# EAGLE design usbledminiv1 (EAGLE 5.06)
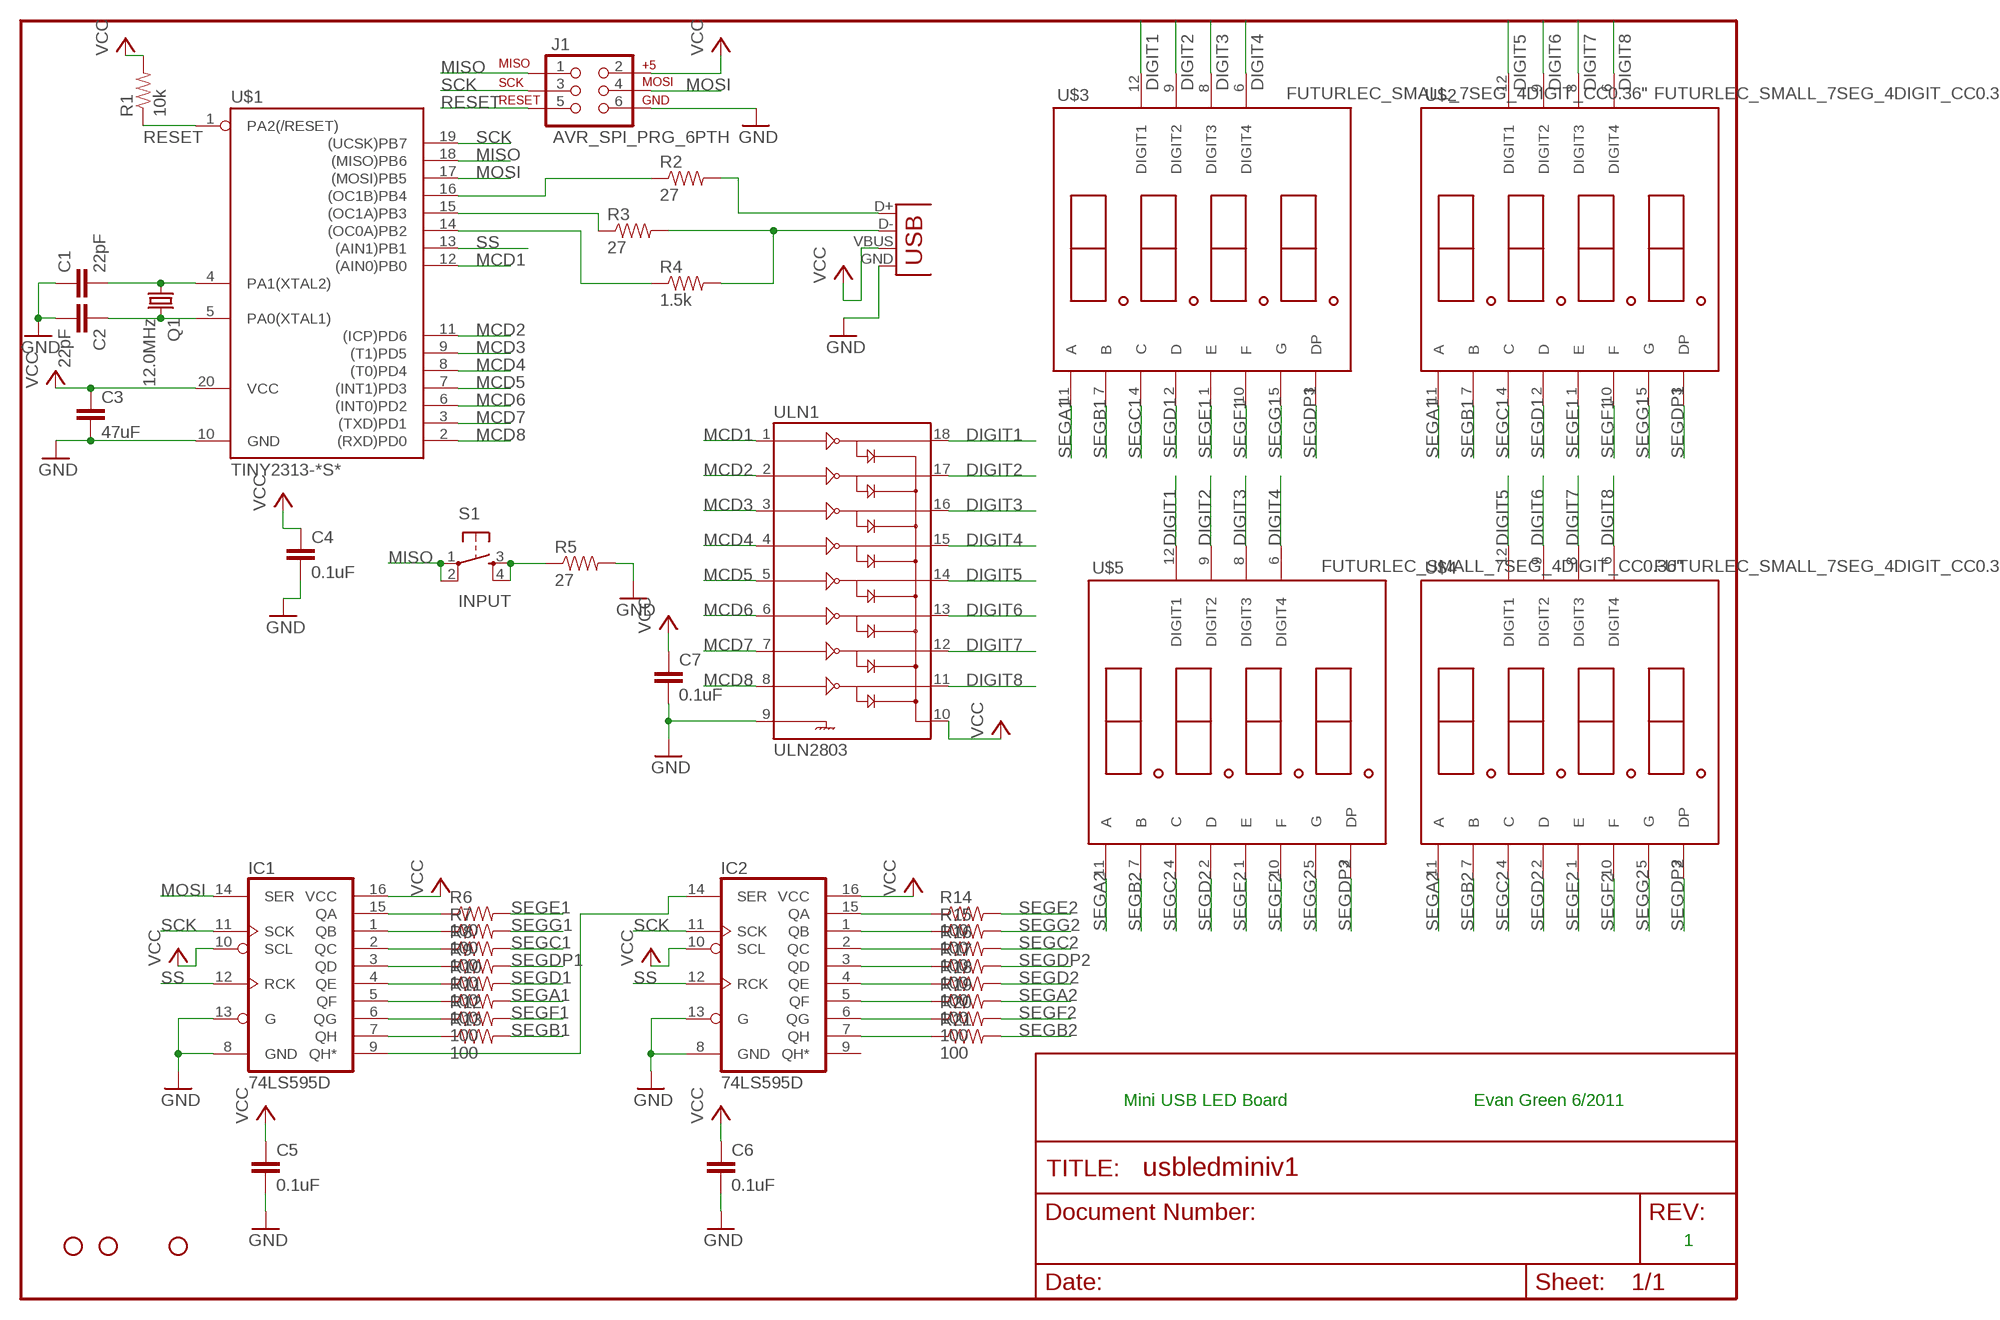
[diagram p0: schematic, sheet 1]

## Parts
C1  22pF  CAP0402-CAP  [0402-CAP]
C2  22pF  CAP0402-CAP  [0402-CAP]
C3  47uF  CAP1210  [1210]
C4  0.1uF  CAP0402-CAP  [0402-CAP]
C5  0.1uF  CAP0402-CAP  [0402-CAP]
C6  0.1uF  CAP0402-CAP  [0402-CAP]
C7  0.1uF  CAP0402-CAP  [0402-CAP]
IC1  74LS595D  [SO16]
IC2  74LS595D  [SO16]
J1  AVR_SPI_PRG_6PTH  [2X3]
JP1  STAND-OFF  [STAND-OFF]
JP2  STAND-OFF  [STAND-OFF]
JP4  STAND-OFF  [STAND-OFF]
Q1  12.0MHz  CRYSTALTC38H  [TC38H]
R1  10k  RESISTOR0402-RES  [0402-RES]
R2  27  RESISTOR0402-RES  [0402-RES]
R3  27  RESISTOR0402-RES  [0402-RES]
R4  1.5k  RESISTOR0402-RES  [0402-RES]
R5  27  RESISTOR0402-RES  [0402-RES]
R6  100  RESISTOR0402-RES  [0402-RES]
R7  100  RESISTOR0402-RES  [0402-RES]
R8  100  RESISTOR0402-RES  [0402-RES]
R9  100  RESISTOR0402-RES  [0402-RES]
R10  100  RESISTOR0402-RES  [0402-RES]
R11  100  RESISTOR0402-RES  [0402-RES]
R12  100  RESISTOR0402-RES  [0402-RES]
R13  100  RESISTOR0402-RES  [0402-RES]
R14  100  RESISTOR0402-RES  [0402-RES]
R15  100  RESISTOR0402-RES  [0402-RES]
R16  100  RESISTOR0402-RES  [0402-RES]
R17  100  RESISTOR0402-RES  [0402-RES]
R18  100  RESISTOR0402-RES  [0402-RES]
R19  100  RESISTOR0402-RES  [0402-RES]
R20  100  RESISTOR0402-RES  [0402-RES]
R21  100  RESISTOR0402-RES  [0402-RES]
S1  INPUT  TAC_SWITCHSMD  [TACTILE_SWITCH_SMD]
U$1  TINY2313-*S*  [SO20L$]
U$2  FUTURLEC_SMALL_7SEG_4DIGIT_CC0.36"  [FUTURLEC_SMALL_7SEG_4DIGIT_CC]
U$3  FUTURLEC_SMALL_7SEG_4DIGIT_CC0.36"  [FUTURLEC_SMALL_7SEG_4DIGIT_CC]
U$4  FUTURLEC_SMALL_7SEG_4DIGIT_CC0.36"  [FUTURLEC_SMALL_7SEG_4DIGIT_CC]
U$5  FUTURLEC_SMALL_7SEG_4DIGIT_CC0.36"  [FUTURLEC_SMALL_7SEG_4DIGIT_CC]
ULN1  ULN2803  ULN2803SOICW  [SO18L]
X1  USBSMD  [USB-MINIB]

## Nets
DIGIT1: U$3.12(DIGIT1) U$5.12(DIGIT1) ULN1.18
DIGIT2: U$3.9(DIGIT2) U$5.9(DIGIT2) ULN1.17
DIGIT3: U$3.8(DIGIT3) U$5.8(DIGIT3) ULN1.16
DIGIT4: U$3.6(DIGIT4) U$5.6(DIGIT4) ULN1.15
DIGIT5: U$2.12(DIGIT1) U$4.12(DIGIT1) ULN1.14
DIGIT6: U$2.9(DIGIT2) U$4.9(DIGIT2) ULN1.13
DIGIT7: U$2.8(DIGIT3) U$4.8(DIGIT3) ULN1.12
DIGIT8: U$2.6(DIGIT4) U$4.6(DIGIT4) ULN1.11
GND: C1.1 C2.2 C3.2 C4.2 C5.2 C6.2 C7.2 IC1.8(GND) IC1.13(G) IC2.8(GND) IC2.13(G) J1.6 R5.2 U$1.10(GND) ULN1.9 X1.GND
MCD1: U$1.12((AIN0)PB0) ULN1.1
MCD2: U$1.11((ICP)PD6) ULN1.2
MCD3: U$1.9((T1)PD5) ULN1.3
MCD4: U$1.8((T0)PD4) ULN1.4
MCD5: U$1.7((INT1)PD3) ULN1.5
MCD6: U$1.6((INT0)PD2) ULN1.6
MCD7: U$1.3((TXD)PD1) ULN1.7
MCD8: U$1.2((RXD)PD0) ULN1.8
MISO: J1.1 S1.1 S1.2 U$1.18((MISO)PB6)
MOSI: IC1.14(SER) J1.4 U$1.17((MOSI)PB5)
N$1: IC1.7(QH) R13.1
N$2: C1.2 Q1.1 U$1.4(PA1(XTAL2))
N$4: C2.1 Q1.2 U$1.5(PA0(XTAL1))
N$6: IC1.9(QH*) IC2.14(SER)
N$9: IC1.1(QB) R7.1
N$10: IC1.2(QC) R8.1
N$11: IC1.15(QA) R6.1
N$12: IC1.3(QD) R9.1
N$13: IC1.4(QE) R10.1
N$14: R2.1 U$1.16((OC1B)PB4)
N$15: R3.1 U$1.15((OC1A)PB3)
N$16: R4.1 U$1.14((OC0A)PB2)
N$17: IC1.5(QF) R11.1
N$18: IC1.6(QG) R12.1
N$19: IC2.1(QB) R15.1
N$23: R5.1 S1.3 S1.4
N$28: R3.2 R4.2 X1.D-
N$29: R2.2 X1.D+
N$32: IC2.15(QA) R14.1
N$33: IC2.2(QC) R16.1
N$34: IC2.3(QD) R17.1
N$35: IC2.4(QE) R18.1
N$36: IC2.5(QF) R19.1
N$37: IC2.6(QG) R20.1
N$38: IC2.7(QH) R21.1
RESET: J1.5 R1.1 U$1.1(PA2(/RESET))
SCK: IC1.11(SCK) IC2.11(SCK) J1.3 U$1.19((UCSK)PB7)
SEGA1: R11.2 U$2.11(A) U$3.11(A)
SEGA2: R19.2 U$4.11(A) U$5.11(A)
SEGB1: R13.2 U$2.7(B) U$3.7(B)
SEGB2: R21.2 U$4.7(B) U$5.7(B)
SEGC1: R8.2 U$2.4(C) U$3.4(C)
SEGC2: R16.2 U$4.4(C) U$5.4(C)
SEGD1: R10.2 U$2.2(D) U$3.2(D)
SEGD2: R18.2 U$4.2(D) U$5.2(D)
SEGDP1: R9.2 U$2.3(DP) U$3.3(DP)
SEGDP2: R17.2 U$4.3(DP) U$5.3(DP)
SEGE1: R6.2 U$2.1(E) U$3.1(E)
SEGE2: R14.2 U$4.1(E) U$5.1(E)
SEGF1: R12.2 U$2.10(F) U$3.10(F)
SEGF2: R20.2 U$4.10(F) U$5.10(F)
SEGG1: R7.2 U$2.5(G) U$3.5(G)
SEGG2: R15.2 U$4.5(G) U$5.5(G)
SS: IC1.12(RCK) IC2.12(RCK) U$1.13((AIN1)PB1)
VCC: C3.1 C4.1 C5.1 C6.1 C7.1 IC1.10(SCL) IC1.16(VCC) IC2.10(SCL) IC2.16(VCC) J1.2 R1.2 U$1.20(VCC) ULN1.10 X1.VBUS
Unconnected: IC2.9(QH*)

## Notes on the sheet
- Mini USB LED Board | Evan Green 6/2011
- 1

## Library data of the parts
C1-C7 = SparkFun:CAP: Capacitor Standard 0603 ceramic capacitor, and 0.1" leaded capacitor.
IC1 IC2 = SparkFun:74*595: 8-bit SHIFT REGISTER, output latch
J1 = SparkFun:AVR_SPI_PRG_6: AVR ISP 6 Pin This is the reduced ISP connector for AVR programming. Common on Arduino. This footprint will take up less PCB space and can be used with a 10-pin to 6-pin adapter such as SKU: BOB-08508
JP1 JP2 JP4 = SparkFun:STAND-OFF: Stand Off This is the mechanical footprint for a #4 phillips button head screw. Use the keepout ring to avoid running the screw head into surrounding components. SKU : PRT-00447
Q1 = SparkFun:CRYSTAL: Crystals Various standard crystals. Proven footprints. Spark Fun Electronics SKU : COM-00534
R1-R21 = SparkFun:RESISTOR: Resistor Basic schematic elements and footprints for 0603, 1206, and PTH 1/10th watt (small) resistors.
S1 = SparkFun:TAC_SWITCH: Momentary Switch Button commonly used for reset or general input. Spark Fun Electronics SKU : COM-00097
U$1 = avr-6:TINY2313*: Atmel Tiny2313 2K Flash, 128 bytes EEPROM, 128 bytes RAM
U$2-U$5 = Evan:FUTURLEC_SMALL_7SEG_4DIGIT_CC: Futurlec 0.36" Common Cathode 4-Digit 7-Segment LED Display
ULN1 = SparkFun:ULN2803: Darlington Driver ULN2803 Darlington array. 500mA max per channel, 8-channel package. Spark Fun Electronics SKU : COM-00312
X1 = SparkFun:USB: USB Connectors USB-B-PTH is fully proven SKU : PRT-00139 USB-miniB is fully proven SKU : PRT-00587 USB-A-PCB is untested. USB-A-H is throughly reviewed, but untested. Spark Fun Electronics SKU : PRT-00437 USB-B-SMT is throughly reviewed, but untested. Needs silkscreen touching up. USB-A-S has not been used/tested USB-MB-H has not been used/tested

## Net classes
0 default: width 0.305 mm

## Board
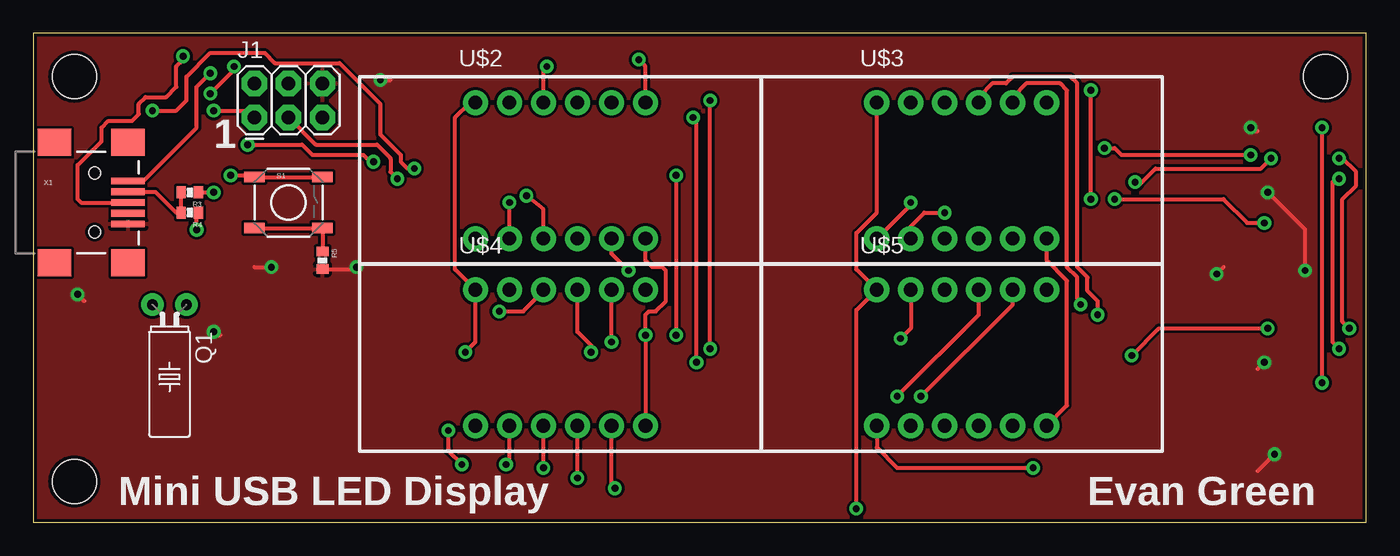
[diagram p1: board, top side]
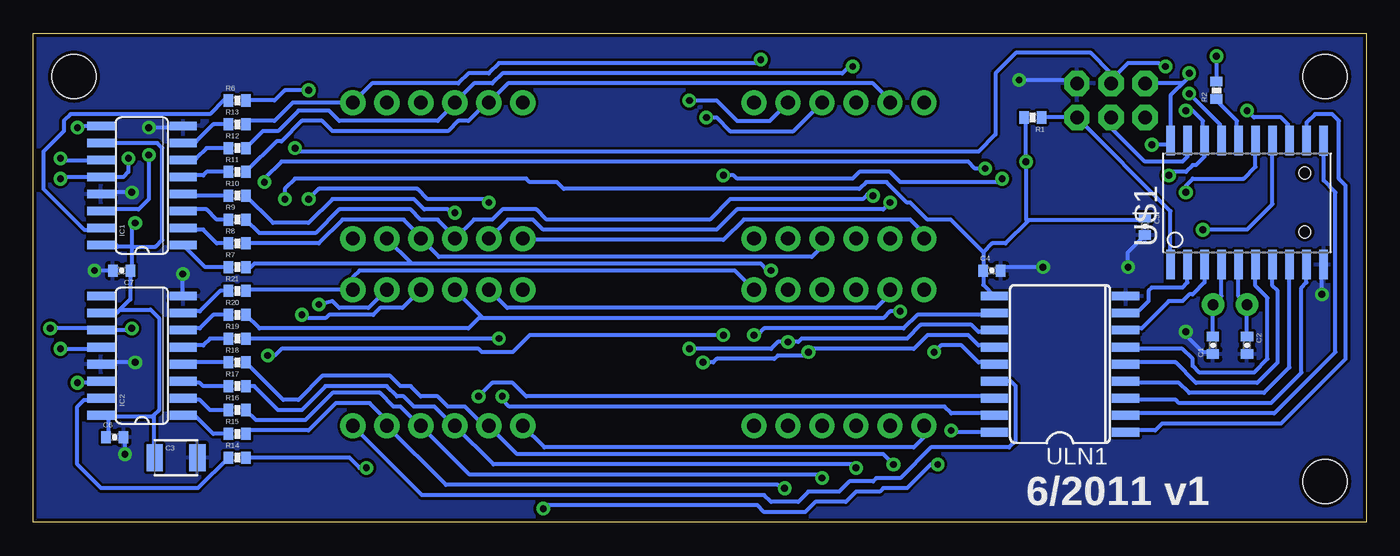
[diagram p2: board, bottom side, seen from below]

Size 99.55 x 36.5 mm. Coordinates in mm from the lower left corner, seen from the top.
Outline: 0,0 99.55,0 99.55,36.5 0,36.5 0,0
Copper layers (1*16): Top 0.035mm / dielectric 1.5mm / Bottom 0.035mm
Design rules "SparkFun": minimum track width 8mil, minimum drill 20mil, track to track 8mil, track to pad 8mil, pad to pad 8mil, via to via 8mil, smd to smd 8mil, copper to edge 10mil, drill to drill 8mil, minimum pad ring 12mil, minimum via ring 10mil, stop-mask expansion 4mil, vias tented up to drill 25mil, thermal gap 10mil

### Footprints (pad centres in the part's own frame; a part is rotated, then mirrored left to right if it is on the bottom)
0402-CAP = smd 0.7 x 0.9: 1 -0.65,0; 2 0.65,0
1210 = smd 1.2 x 2: 1 -1.6,0; 2 1.6,0
SO16 = smd 0.66 x 2.032: 1 -4.445,-3.073; 2 -3.175,-3.073; 3 -1.905,-3.073; 4 -0.635,-3.073; 5 0.635,-3.073; 6 1.905,-3.073; 7 3.175,-3.073; 8 4.445,-3.073; 9 4.445,3.073; 10 3.175,3.073; 11 1.905,3.073; 12 0.635,3.073; 13 -0.635,3.073; 14 -1.905,3.073; 15 -3.175,3.073; 16 -4.445,3.073
2X3 = drill 1.016 pad 1.88 octagon: 1 0,0; 2 0,2.54; 3 2.54,0; 4 2.54,2.54; 5 5.08,0; 6 5.08,2.54
STAND-OFF = hole 3.302: 0,0
TC38H = drill 0.813 pad 1.676 round: 1 -1.27,0; 2 1.27,0
0402-RES = smd 0.7 x 0.9: 1 -0.65,0; 2 0.65,0
TACTILE_SWITCH_SMD = smd 1.524 x 0.762: 1 -2.54,1.905; 2 2.54,1.905; 3 -2.54,-1.905; 4 2.54,-1.905
SO20L$ = smd 0.61 x 2.21: 1 -5.715,-4.636; 2 -4.445,-4.636; 3 -3.175,-4.636; 4 -1.905,-4.636; 5 -0.635,-4.636; 6 0.635,-4.636; 7 1.905,-4.636; 8 3.175,-4.636; 9 4.445,-4.636; 10 5.715,-4.636; 11 5.715,4.61; 12 4.445,4.636; 13 3.175,4.636; 14 1.905,4.636; 15 0.635,4.636; 16 -0.635,4.636; 17 -1.905,4.636; 18 -3.175,4.636; 19 -4.445,4.636; 20 -5.715,4.636
FUTURLEC_SMALL_7SEG_4DIGIT_CC = drill 1.016 pad 1.88 round: 1 -6.35,-3.97; 2 -3.81,-3.97; 3 -1.27,-3.97; 4 1.27,-3.97; 5 3.81,-3.97; 6 6.35,-3.97; 7 6.35,6.19; 8 3.81,6.19; 9 1.27,6.19; 10 -1.27,6.19; 11 -3.81,6.19; 12 -6.35,6.19
SO18L = smd 0.66 x 2.032: 1 -0.635,-4.902; 2 0.635,-4.902; 3 1.905,-4.902; 4 3.175,-4.902; 5 4.445,-4.902; 6 5.715,-4.902; 7 6.985,-4.902; 8 8.255,-4.902; 9 9.525,-4.902; 10 9.525,4.902; 11 8.255,4.902; 12 6.985,4.902; 13 5.715,4.902; 14 4.445,4.902; 15 3.175,4.902; 16 1.905,4.902; 17 0.635,4.902; 18 -0.635,4.902
USB-MINIB = smd 2.5 x 0.5: D+ 2.5,0; D- 2.5,0.8; GND 2.5,-1.6; ID 2.5,-0.8; VBUS 2.5,1.6 | smd 2.5 x 2: GND@1 -3,-4.5; GND@2 -3,4.5; GND@3 2.5,4.5; GND@4 2.5,-4.5 | hole 0.9: 0,2.2; 0,-2.2

### Placement (x,y rotation side)
C1  11.43,13.21 90 bottom
C2  8.89,13.21 270 bottom
C3  88.9,4.83 0 bottom
C4  27.94,18.8 0 bottom
C5  16.51,22.1 270 bottom
C6  93.47,6.35 0 bottom
C7  92.96,18.8 180 bottom
IC1  91.44,25.15 90 bottom
IC2  91.44,12.45 90 bottom
J1  16.51,30.23 0 top
JP1  3.05,33.27 0 top
JP2  96.52,33.27 0 top
JP4  3.05,3.05 0 top
Q1  10.16,16.26 180 top
R1  24.89,30.23 180 bottom
R2  11.18,32.26 90 bottom
R3  11.68,24.64 180 top
R4  11.68,23.11 180 top
R5  21.59,19.56 270 top
R6  84.33,31.5 0 bottom
R7  84.33,19.05 0 bottom
R8  84.33,20.83 0 bottom
R9  84.33,22.61 0 bottom
R10  84.33,24.38 0 bottom
R11  84.33,26.16 0 bottom
R12  84.33,27.94 0 bottom
R13  84.33,29.72 0 bottom
R14  84.33,4.83 0 bottom
R15  84.33,6.6 0 bottom
R16  84.33,8.38 0 bottom
R17  84.33,10.16 0 bottom
R18  84.33,11.94 0 bottom
R19  84.33,13.72 0 bottom
R20  84.33,15.49 0 bottom
R21  84.33,17.27 0 bottom
S1  19.05,23.88 0 top
U$1  8.89,23.88 0 bottom
U$2  39.37,25.15 0 top
U$3  69.34,25.15 0 top
U$4  39.37,11.18 0 top
U$5  69.34,11.18 0 top
ULN1  22.86,7.37 90 bottom
X1  4.57,23.88 0 top

### Tracks (layer width: path | path; a pad name or v marks a point on that pad's centre or on a via)
DIGIT1  (via drill 0.51)
  Top 0.305: v61.47,1.02 61.47,15.84 U$5.12 61.47,18.89 61.47,21.59 62.99,23.11 U$3.12 | v32,4.32 30.99,5.33 v30.99,6.86
  Bottom 0.305: v61.47,1.02 61.21,1.27 45.47,1.27 44.96,0.76 41.91,0.76 41.15,1.52 38.86,1.52 38.1,2.29 36.32,2.29 36.07,2.54 34.29,2.54 32.51,4.32 v32,4.32 | v30.99,6.86 30.86,6.73 ULN1.18
DIGIT2  (via drill 0.51)
  Top 0.305: v64.52,9.4 70.61,15.49 U$5.9 | v79.5,15.49 79.5,16.51 78.74,17.27 78.74,18.29 77.98,19.05 77.98,32.77 77.47,33.27 73.15,33.27 72.64,32.77 71.63,32.77 70.61,31.75 U$3.9
  Bottom 0.305: ULN1.17 27.89,8.13 30.99,8.13 31.5,8.64 64.01,8.64 64.52,9.14 v64.52,9.4 | U$5.9 71.98,16 73.66,16 74.17,15.49 77.47,15.49 77.72,15.24 78.99,15.24 79.25,15.49 v79.5,15.49
DIGIT3  (via drill 0.51)
  Top 0.305: v66.29,9.4 73.15,16.26 U$5.8 | v78.23,16.26 77.98,16.76 77.98,18.29 77.22,19.05 77.22,32.26 76.71,32.77 74.17,32.77 73.15,31.75 U$3.8
  Bottom 0.305: ULN1.16 27.89,9.4 62.74,9.4 63.75,10.41 65.28,10.41 v66.29,9.4 | U$5.8 74.52,16 76.71,16 77.22,16.51 v78.23,16.26
DIGIT4
  Top 0.305: U$5.6 77.22,8.73 77.22,18.03 75.69,19.56 U$3.6
  Bottom 0.305: U$5.6 70.52,2.03 44.96,2.03 44.45,1.52 42.42,1.52 41.66,2.29 39.37,2.29 38.61,3.05 36.83,3.05 36.58,3.3 34.8,3.3 32.51,5.59 26.67,5.59 26.16,6.1 26.16,10.16 26.54,10.54 ULN1.15
DIGIT5  (via drill 0.51)
  Top 0.305: v32.26,12.7 33.02,13.46 U$4.12 31.5,18.89 31.5,30.23 32.61,31.34 U$2.12
  Bottom 0.305: ULN1.14 27.89,11.94 28.96,11.94 30.23,13.21 31.75,13.21 v32.26,12.7
DIGIT6  (via drill 0.51)
  Top 0.305: U$4.9 40.64,14.22 41.66,13.21 v41.66,12.7 | v49.28,30.23 49.53,29.97 v49.53,11.94
  Bottom 0.305: ULN1.13 27.89,13.21 28.96,13.21 29.72,13.97 32.77,13.97 33.78,12.95 41.91,12.95 v41.66,12.7 41.91,12.45 43.94,12.45 44.2,12.19 48.51,12.19 48.77,11.94 v49.53,11.94 | U$2.9 42.77,29.21 47.5,29.21 48.51,30.23 v49.28,30.23
DIGIT7  (via drill 0.51)
  Top 0.305: v43.18,13.46 U$4.8 | v50.55,12.95 v50.55,31.5
  Bottom 0.305: ULN1.12 27.89,14.22 28.96,14.22 29.46,14.73 33.27,14.73 34.29,13.72 42.16,13.72 42.42,13.46 v43.18,13.46 43.94,13.46 44.45,12.95 v50.55,12.95 | U$2.8 44.54,29.97 46.99,29.97 48.51,31.5 v50.55,31.5
DIGIT8  (via drill 0.51)
  Top 0.305: U$2.6 45.72,19.56 46.23,19.05 46.99,19.05 47.24,18.8 47.24,16.51 46.48,15.75 45.97,15.75 45.72,15.49 v45.72,13.97 U$4.6
  Bottom 0.305: ULN1.11 27.89,15.49 33.53,15.49 34.54,14.48 44.96,14.48 45.47,13.97 v45.72,13.97
GND  (via drill 0.51)
  Top 0.305: v24.13,19.05 23.99,18.91 R5.2 | 91.44,3.81 v92.71,5.08 | v13.46,14.22 13.72,13.97 13.97,13.97 | v3.3,17.02 3.81,16.51 | 16.51,19.05 v17.78,19.05 | v25.91,33.02 26.67,33.02 | v91.95,11.94 91.44,11.43 | v88.39,18.54 88.9,19.05 | 95.25,19.05 v95,18.8 95,21.84 v92.2,24.64 | v90.93,29.46 91.19,29.21 91.44,29.21
  Bottom 0.305: C4.2 27.04,19.05 v24.13,19.05 | C6.2 92.71,6.24 v92.71,5.08 | C1.1 11.57,12.7 12.19,12.7 13.46,13.97 v13.46,14.22 | U$1.10 3.3,19.11 v3.3,17.02 | C5.2 17.78,20.18 v17.78,19.05 | J1.6 21.84,33.02 v25.91,33.02 | IC2.13 94.39,11.94 v91.95,11.94 | IC2.8 88.39,16.92 v88.39,18.54 | C7.2 v95,18.8 | IC1.8 88.49,29.46 v90.93,29.46 | IC1.13 94.39,24.64 v92.2,24.64
  pour Top: 0,0 99.57,0 99.57,36.32 0,36.32
  pour Bottom: 0,0 99.57,0 99.57,36.32 0,36.32
MCD1
  Bottom 0.305: ULN1.1 17.83,6.86 15.75,6.86 15.24,7.37 6.35,7.37 1.52,12.19 1.52,25.15 2.03,25.65 2.03,29.97 2.54,30.48 3.81,30.48 4.45,29.84 U$1.12
MCD2
  Bottom 0.305: ULN1.2 17.83,8.13 6.86,8.13 2.29,12.7 2.29,24.64 3.17,25.53 U$1.11
MCD3
  Bottom 0.305: ULN1.3 17.83,9.14 14.22,9.14 13.97,8.89 7.11,8.89 4.83,11.18 4.83,17.53 4.45,17.91 U$1.9
MCD4
  Bottom 0.305: ULN1.4 17.83,10.41 13.97,10.41 13.21,9.65 7.62,9.65 5.71,11.56 U$1.8
MCD5
  Bottom 0.305: ULN1.5 17.83,11.94 14.22,11.94 12.7,10.41 8.13,10.41 6.6,11.94 6.6,17.27 6.99,17.65 U$1.7
MCD6
  Bottom 0.305: ULN1.6 17.83,12.95 13.72,12.95 12.95,12.19 12.95,11.68 12.45,11.18 8.38,11.18 7.37,12.19 7.37,16.76 8.26,17.65 U$1.6
MCD7
  Bottom 0.305: ULN1.7 17.83,14.48 16.76,14.48 14.73,16.51 13.72,16.51 13.21,17.02 12.95,17.02 12.06,17.91 U$1.3
MCD8
  Bottom 0.305: ULN1.8 17.83,15.75 17.02,15.75 16.26,16.51 16.26,17.27 16,17.53 13.72,17.53 13.34,17.91 U$1.2
MISO  (via drill 0.51)
  Top 0.305: J1.1 16.51,30.73 16.26,30.99 16,30.73 v13.46,30.73 | S1.2 S1.1 16.38,25.91 v14.73,25.91
  Bottom 0.305: v14.73,25.91 14.48,26.16 13.46,26.16 12.95,26.67 12.7,26.67 12.06,27.3 U$1.18 12.19,28.64 12.19,29.97 12.95,30.73 v13.46,30.73
MOSI  (via drill 0.51)
  Top 0.305: v13.21,32 14.99,33.78 v14.99,34.04 | v80.01,27.94 80.77,27.94 81.28,27.43 v90.93,27.43
  Bottom 0.305: IC1.14 94.39,23.37 91.69,23.37 90.93,24.13 v90.93,27.43 | U$1.17 10.92,28.64 10.92,29.72 v13.21,32 | v14.99,34.04 15.24,34.04 15.49,34.29 17.78,34.29 19.05,33.02 J1.4 19.05,33.53 20.57,35.05 26.16,35.05 27.69,33.53 27.69,28.96 28.96,27.69 79.76,27.69 v80.01,27.94
N$1
  Bottom 0.305: IC1.7 88.24,28.45 87.38,28.45 86.11,29.72 R13.1
N$2
  Bottom 0.305: U$1.4 10.79,16.89 Q1.1 C1.2
N$4
  Bottom 0.305: U$1.5 9.53,16.89 Q1.2 C2.1
N$6  (via drill 0.51)
  Top 0.305: v96.27,10.41 v96.27,29.46
  Bottom 0.305: IC2.14 94.64,10.41 v96.27,10.41 | v96.27,29.46 96.14,29.59 IC1.9
N$9
  Bottom 0.305: IC1.1 86.72,19.05 R7.1
N$10
  Bottom 0.305: IC1.2 88.24,21.84 86.87,21.84 85.85,20.83 R8.1
N$11
  Bottom 0.305: IC1.15 94.64,21.84 95.76,21.84 98.81,24.89 98.81,27.69 97.28,29.21 97.28,29.97 96.77,30.48 86.36,30.48 85.34,31.5 R6.1
N$12
  Bottom 0.305: IC1.3 88.24,23.37 86.61,23.37 85.85,22.61 R9.1
N$13
  Bottom 0.305: IC1.4 88.24,24.38 R10.1
N$14
  Bottom 0.305: U$1.16 9.4,28.64 9.65,28.89 9.65,29.97 11.18,31.5 R2.1
N$15  (via drill 0.51)
  Top 0.305: R3.1 v13.46,24.64
  Bottom 0.305: U$1.15 8.26,26.54 9.14,25.65 12.95,25.65 13.46,25.15 v13.46,24.64
N$16  (via drill 0.51)
  Top 0.305: R4.1 12.19,22.97 v12.19,21.84
  Bottom 0.305: U$1.14 6.99,23.75 8.89,21.84 v12.19,21.84
N$17
  Bottom 0.305: IC1.5 88.24,25.91 86.87,25.91 86.61,26.16 R11.1
N$18
  Bottom 0.305: IC1.6 88.24,27.18 87.38,27.18 86.61,27.94 R12.1
N$19
  Bottom 0.305: IC2.1 88.24,7.87 87.38,7.87 86.11,6.6 R15.1
N$23
  Top 0.305: R5.1 S1.4 S1.3
N$28
  Top 0.305: 7.11,24.64 X1.D- 9.11,24.68 10.67,23.11 R4.2 R3.2
N$29  (via drill 0.51)
  Top 0.305: X1.D+ 3.56,23.88 3.3,24.13 3.3,26.67 5.08,28.45 5.08,29.46 5.59,29.97 7.37,29.97 7.87,30.48 7.87,31.24 8.38,31.75 9.91,31.75 10.67,32.51 10.67,34.04 11.18,34.54 v11.18,34.8
  Bottom 0.305: v11.18,34.8 R2.2
N$32
  Bottom 0.305: IC2.15 94.64,9.14 95.76,9.14 96.27,8.64 96.27,4.32 94.49,2.54 87.26,2.54 R14.1
N$33
  Bottom 0.305: IC2.2 88.24,9.14 87.12,9.14 86.36,8.38 R16.1
N$34
  Bottom 0.305: IC2.3 88.24,10.41 87.12,10.41 86.87,10.16 R17.1
N$35
  Bottom 0.305: IC2.4 88.24,11.94 R18.1
N$36
  Bottom 0.305: IC2.5 88.24,13.21 86.87,13.21 86.36,13.72 R19.1
N$37
  Bottom 0.305: IC2.6 88.24,14.48 87.12,14.48 86.11,15.49 R20.1
N$38
  Bottom 0.305: IC2.7 88.24,15.75 87.12,15.75 85.6,17.27 R21.1
RESET
  Bottom 0.305: U$1.1 14.61,23.24 J1.5 R1.1
SCK  (via drill 0.51)
  Top 0.305: v98.3,14.48 97.79,14.99 97.79,24.13 98.81,25.15 98.81,26.16 97.79,27.18 v97.54,27.18 | J1.3 21.08,28.19 25.65,28.19 26.67,27.18 26.67,26.16 v27.18,25.65 | v82.04,12.45 84.07,14.48 v92.2,14.48 | v48.01,25.91 v48.01,13.97
  Bottom 0.305: v98.3,14.48 94.64,14.48 IC2.11 92.33,14.35 v92.2,14.48 | v97.54,27.18 97.41,27.05 IC1.11 | U$1.19 13.34,27.3 13.72,26.92 16.51,26.92 19.05,29.46 J1.3 | v48.01,13.97 62.48,13.97 63.75,12.7 66.04,12.7 66.29,12.95 81.03,12.95 81.53,12.45 v82.04,12.45 | v27.18,25.65 27.43,25.4 34.8,25.4 35.56,26.16 37.85,26.16 38.35,25.65 46.99,25.65 47.24,25.91 v48.01,25.91
SEGA1
  Bottom 0.305: R11.2 81.39,28.45 81.03,28.45 79.5,29.97 77.98,29.97 77.22,29.21 68.58,29.21 67.82,29.97 67.06,29.97 65.69,31.34 U$3.11 64.1,32.77 36.83,32.77 35.56,31.5 U$2.11
SEGA2  (via drill 0.51)
  Top 0.305: v64.77,13.72 65.53,14.48 U$5.11
  Bottom 0.305: U$5.11 64.17,16 36.58,16 35.56,17.02 U$4.11 | v64.77,13.72 R19.2
SEGB1  (via drill 0.51)
  Top 0.305: v45.21,34.54 45.72,34.04 U$2.7
  Bottom 0.305: R13.2 83.42,29.97 81.53,29.97 80.17,31.34 U$3.7 74.26,32.77 67.82,32.77 67.06,33.53 65.53,33.53 64.77,34.29 45.47,34.29 v45.21,34.54
SEGB2
  Bottom 0.305: R21.2 83.58,17.37 U$5.7 75.69,18.29 75.18,18.8 47.15,18.8 U$4.7
SEGC1
  Bottom 0.305: U$2.4 40.64,20.57 41.4,19.81 69.25,19.81 U$3.4 70.61,21.34 71.88,22.61 76.45,22.61 78.23,20.83 R8.2
SEGC2  (via drill 0.51)
  Top 0.305: v40.64,3.3 U$4.4
  Bottom 0.305: v40.64,3.3 40.89,3.56 66.96,3.56 U$5.4 70.71,7.21 72.14,8.64 72.64,8.64 73.66,9.65 77.22,9.65 79.25,7.62 82.92,7.62 R16.2
SEGD1  (via drill 0.51)
  Top 0.305: U$2.2 v35.56,23.88 | v68.07,23.11 66.55,23.11 65.53,22.1 U$3.2
  Bottom 0.305: U$3.2 64.1,22.61 62.23,22.61 61.47,21.84 48.51,21.84 46.99,23.37 36.07,23.37 v35.56,23.88 | R10.2 81.65,22.35 78.99,22.35 77.22,24.13 71.12,24.13 70.36,23.37 68.58,23.37 68.33,23.11 v68.07,23.11
SEGD2  (via drill 0.51)
  Top 0.305: v35.31,4.32 35.56,4.57 U$4.2
  Bottom 0.305: v35.31,4.32 36.07,5.08 63.41,5.08 U$5.2 65.88,7.21 67.31,8.64 68.58,8.64 69.34,9.4 70.61,9.4 71.37,10.16 72.14,10.16 72.9,10.92 77.98,10.92 79.76,9.14 80.88,9.14 R18.2
SEGDP1  (via drill 0.51)
  Top 0.305: v36.83,24.38 38.1,23.37 U$2.3
  Bottom 0.305: v36.83,24.38 37.08,24.64 37.59,24.13 47.5,24.13 49.02,22.61 61.21,22.61 61.98,23.37 64.52,23.37 65.28,22.61 66.64,22.61 U$3.3 68.07,21.34 69.34,22.61 70.61,22.61 71.37,23.37 76.71,23.37 78.49,21.59 82.66,21.59 R9.2
SEGDP2  (via drill 0.51)
  Top 0.305: v38.1,4.06 U$4.3
  Bottom 0.305: v38.1,4.06 38.35,4.32 65.18,4.32 U$5.3 68.17,7.21 69.6,8.64 71.12,8.64 71.88,9.4 72.39,9.4 73.15,10.16 77.72,10.16 79.5,8.38 81.28,8.38 83.06,10.16 R17.2
SEGE1  (via drill 0.51)
  Top 0.305: U$3.1 65.53,23.72 v65.53,23.88 | v78.99,24.13 v78.99,32.26
  Bottom 0.305: U$3.1 62.9,21.08 48.01,21.08 46.48,22.61 34.04,22.61 33.02,21.59 U$2.1 | v65.53,23.88 65.79,24.13 70.1,24.13 70.87,24.89 78.23,24.89 v78.99,24.13 | R6.2 81.53,31.5 80.77,32.26 v78.99,32.26
SEGE2  (via drill 0.51)
  Top 0.305: v74.68,4.06 64.52,4.06 62.99,5.59 U$5.1
  Bottom 0.305: U$5.1 61.37,5.59 33.78,5.59 33.02,6.35 U$4.1 | R14.2 75.95,4.83 75.18,4.06 v74.68,4.06
SEGF1  (via drill 0.51)
  Top 0.305: v38.35,34.04 38.1,33.78 U$2.10
  Bottom 0.305: R12.2 82.41,29.21 81.28,29.21 79.76,30.73 77.47,30.73 76.71,29.97 69.34,29.97 68.07,31.24 U$3.10 66.64,32.77 65.28,32.77 64.52,33.53 39.12,33.53 38.61,34.04 v38.35,34.04
SEGF2  (via drill 0.51)
  Top 0.305: v34.8,15.75 36.58,15.75 38.1,17.27 U$4.10
  Bottom 0.305: 65.95,15.24 U$5.10 | 65.95,15.24 36.07,15.24 35.56,15.75 v34.8,15.75 | R20.2 82.66,14.48 67.06,14.48 66.29,15.24 65.95,15.24
SEGG1  (via drill 0.51)
  Top 0.305: v44.45,18.8 43.18,20.07 U$2.5
  Bottom 0.305: 71.28,19.3 U$3.5 | 71.28,19.3 45.21,19.3 44.7,18.8 v44.45,18.8 | 83.63,19.1 R7.2 83.31,19.05 83.06,19.3 71.28,19.3
SEGG2  (via drill 0.51)
  Top 0.305: v43.43,2.54 43.18,2.79 U$4.5
  Bottom 0.305: v43.43,2.54 43.69,2.54 43.94,2.79 68.74,2.79 U$5.5 73.15,7.62 74.42,8.89 76.96,8.89 78.99,6.86 83.42,6.86 R15.2
SS  (via drill 0.51)
  Top 0.305: v97.54,12.95 97.03,13.46 97.03,25.4 97.28,25.65 v97.54,25.65 | v82.3,25.4 82.55,25.15 83.82,26.42 91.69,26.42 v92.46,27.18 | v8.89,30.73 10.67,30.73 11.43,31.5 11.43,33.27 13.21,35.05 17.27,35.05 18.03,34.29 22.86,34.29 25.91,31.24 25.91,28.96 27.43,27.43 27.43,26.92 27.94,26.42 v28.45,26.42
  Bottom 0.305: IC2.12 94.64,12.95 v97.54,12.95 | v97.54,25.65 97.41,25.78 IC1.12 92.84,25.78 92.46,26.16 v92.46,27.18 | U$1.13 5.59,28.64 5.84,28.89 5.84,29.72 6.35,30.23 8.38,30.23 v8.89,30.73 | v82.3,25.4 82.3,25.65 81.03,26.92 29.72,26.92 29.21,26.42 v28.45,26.42
VCC  (via drill 0.51)
  Top 0.305: X1.VBUS 7.15,25.4 8.13,25.4 12.19,29.46 12.19,32.51 v13.21,33.53 | v16,28.19 20.07,28.19 20.83,27.43 24.64,27.43 25.15,26.92 v25.4,26.92 | v80.77,24.13 88.9,24.13 90.68,22.35 v91.95,22.35
  Bottom 0.305: IC2.16 94.39,7.87 93.98,7.87 | IC2.10 93.34,15.62 93.09,15.88 | C6.1 93.98,6.49 93.98,7.87 | 93.47,20.57 93.22,20.57 93.34,20.7 IC1.16 94.39,20.57 93.47,20.57 | IC1.10 90.3,28.32 89.92,27.94 89.92,21.08 90.42,20.57 92.2,20.57 | 92.2,20.57 93.47,20.57 | v13.21,33.53 13.46,33.02 | 13.46,33.02 14.61,31.88 U$1.20 14.92,28.19 v16,28.19 | 13.46,33.02 13.72,32.77 J1.2 | 93.98,7.87 90.68,7.87 90.55,8 | 90.55,8 90.17,8.38 90.17,15.24 90.81,15.88 93.09,15.88 | 28.59,20.18 27.94,20.83 26.92,20.83 25.27,22.48 25.4,22.61 | 28.59,20.18 C4.1 28.59,17.72 ULN1.10 | R1.2 25.4,30.08 v25.4,26.92 25.4,22.61 | C5.1 16.65,22.61 25.4,22.61 | v80.77,24.13 80.77,24.89 80.01,25.65 62.74,25.65 62.48,25.4 60.45,25.4 59.94,24.89 37.85,24.89 37.34,25.4 35.81,25.4 34.29,23.88 34.04,23.88 32.77,22.61 31.02,22.61 28.59,20.18 | v91.95,22.35 92.2,22.1 92.2,20.57 | 93.09,15.88 92.31,16.65 C7.1 92.2,18.91 92.2,20.57 | C3.1 90.55,4.83 90.55,8

### Text on the board
tPlace: 1 | Mini USB LED Display | Evan Green
bPlace: 6/2011 v1